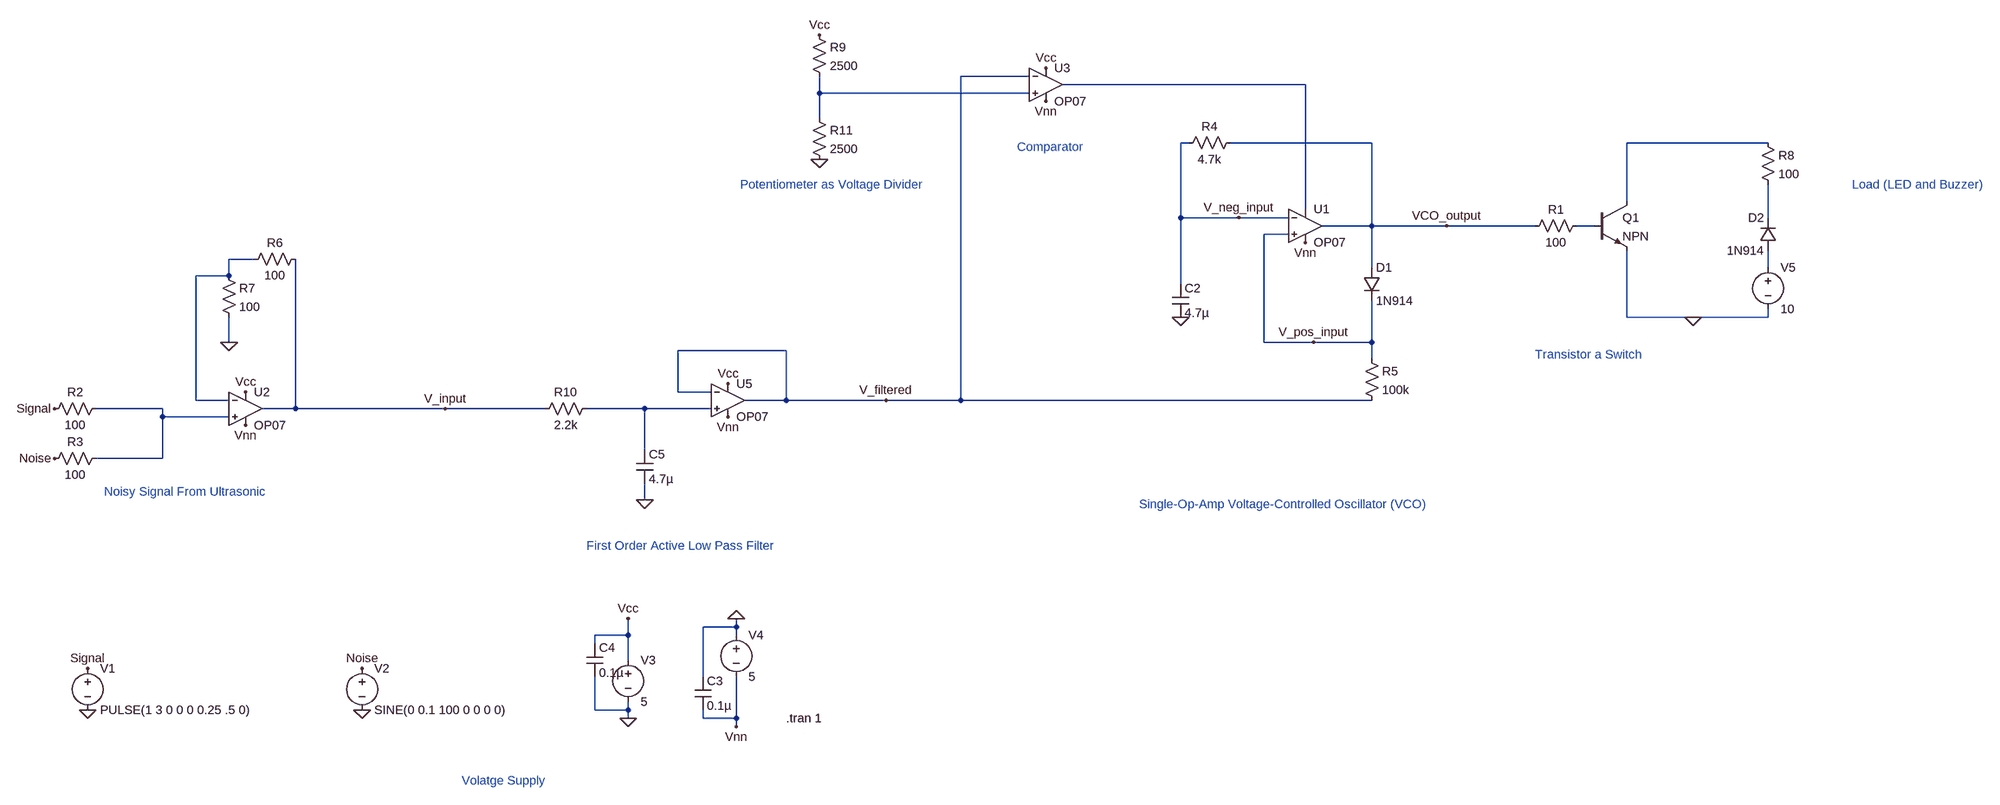
[diagram p0: schematic Group86_LTSPICE_CarSensorasc.asc]
Group86_LTSPICE_CarSensorasc.asc, the LTspice schematic file:
Version 4
SHEET 1 5500 1912
WIRE 1392 -304 1120 -304
WIRE 2048 -288 1456 -288
WIRE 848 -272 848 -304
WIRE 1392 -272 848 -272
WIRE 848 -224 848 -272
WIRE 1824 -176 1808 -176
WIRE 2176 -176 1904 -176
WIRE 3040 -176 2768 -176
WIRE 2768 -64 2768 -176
WIRE 2048 -48 2048 -288
WIRE 1808 -32 1808 -176
WIRE 1920 -32 1808 -32
WIRE 2016 -32 1920 -32
WIRE 3040 -32 3040 -96
WIRE 2176 -16 2176 -176
WIRE 2176 -16 2080 -16
WIRE 2320 -16 2176 -16
WIRE 2592 -16 2320 -16
WIRE 2704 -16 2672 -16
WIRE 2016 0 1968 0
WIRE -240 48 -288 48
WIRE 2176 64 2176 -16
WIRE 3040 64 3040 32
WIRE -288 80 -288 48
WIRE -288 80 -352 80
WIRE 1808 96 1808 -32
WIRE 2768 160 2768 32
WIRE 2896 160 2768 160
WIRE 3040 160 3040 144
WIRE 3040 160 2896 160
WIRE -288 208 -288 160
WIRE 1968 208 1968 0
WIRE 2064 208 1968 208
WIRE 2176 208 2176 128
WIRE 2176 208 2064 208
WIRE 784 224 576 224
WIRE 2176 240 2176 208
WIRE 576 304 576 224
WIRE 640 304 576 304
WIRE -352 320 -352 80
WIRE -288 320 -352 320
WIRE 784 320 784 224
WIRE 784 320 704 320
WIRE 976 320 784 320
WIRE 1120 320 1120 -304
WIRE 1120 320 976 320
WIRE 2176 320 1120 320
WIRE -416 336 -544 336
WIRE -160 336 -160 48
WIRE -160 336 -224 336
WIRE 128 336 -160 336
WIRE 320 336 128 336
WIRE 512 336 400 336
WIRE 640 336 512 336
WIRE -416 352 -416 336
WIRE -288 352 -416 352
WIRE 512 416 512 336
WIRE -416 432 -416 352
WIRE -416 432 -544 432
WIRE 512 512 512 480
WIRE 688 880 688 864
WIRE 688 880 624 880
WIRE 480 896 480 864
WIRE 480 896 416 896
WIRE 688 896 688 880
WIRE 416 912 416 896
WIRE 480 944 480 896
WIRE 624 976 624 880
WIRE 416 1040 416 976
WIRE 480 1040 480 1024
WIRE 480 1040 416 1040
WIRE 480 1056 480 1040
WIRE 624 1056 624 1040
WIRE 688 1056 688 976
WIRE 688 1056 624 1056
WIRE 688 1072 688 1056
FLAG -560 1040 0
FLAG -560 960 Signal
FLAG -32 960 Noise
FLAG -32 1040 0
FLAG -624 336 Signal
FLAG -624 432 Noise
FLAG 480 864 Vcc
FLAG 480 1056 0
FLAG 688 864 0
FLAG 688 1072 Vnn
FLAG -256 304 Vcc
FLAG -256 368 Vnn
FLAG -288 208 0
FLAG 128 336 V_input
FLAG 1808 160 0
FLAG 2048 16 Vnn
FLAG 1424 -320 Vcc
FLAG 1424 -256 Vnn
FLAG 672 288 Vcc
FLAG 672 352 Vnn
FLAG 512 512 0
FLAG 976 320 V_filtered
FLAG 1920 -32 V_neg_input
FLAG 2064 208 V_pos_input
FLAG 2320 -16 VCO_output
FLAG 2896 160 0
FLAG 848 -144 0
FLAG 848 -384 Vcc
SYMBOL voltage -560 944 R0
WINDOW 123 0 0 Left 0
WINDOW 39 0 0 Left 0
SYMATTR InstName V1
SYMATTR Value PULSE(1 3 0 0 0 0.25 .5 0)
SYMBOL voltage -32 944 R0
WINDOW 123 0 0 Left 0
WINDOW 39 0 0 Left 0
SYMATTR InstName V2
SYMATTR Value SINE(0 0.1 100 0 0 0 0)
SYMBOL res -528 320 R90
WINDOW 0 0 56 VBottom 2
WINDOW 3 32 56 VTop 2
SYMATTR InstName R2
SYMATTR Value 100
SYMBOL res -528 416 R90
WINDOW 0 0 56 VBottom 2
WINDOW 3 32 56 VTop 2
SYMATTR InstName R3
SYMATTR Value 100
SYMBOL voltage 480 928 R0
WINDOW 123 0 0 Left 0
WINDOW 39 0 0 Left 0
SYMATTR InstName V3
SYMATTR Value 5
SYMBOL OpAmps\\OP07 -256 272 R0
SYMATTR InstName U2
SYMBOL voltage 688 880 R0
WINDOW 123 0 0 Left 0
WINDOW 39 0 0 Left 0
SYMATTR InstName V4
SYMATTR Value 5
SYMBOL res -304 64 R0
SYMATTR InstName R7
SYMATTR Value 100
SYMBOL res -144 32 R90
WINDOW 0 0 56 VBottom 2
WINDOW 3 32 56 VTop 2
SYMATTR InstName R6
SYMATTR Value 100
SYMBOL cap 608 976 R0
SYMATTR InstName C3
SYMATTR Value 0.1µ
SYMBOL cap 400 912 R0
SYMATTR InstName C4
SYMATTR Value 0.1µ
SYMBOL OpAmps\\OP07 2048 -80 R0
SYMATTR InstName U1
SYMBOL res 1808 -160 R270
WINDOW 0 32 56 VTop 2
WINDOW 3 0 56 VBottom 2
SYMATTR InstName R4
SYMATTR Value 4.7k
SYMBOL cap 1792 96 R0
SYMATTR InstName C2
SYMATTR Value 4.7µ
SYMBOL res 2160 224 R0
SYMATTR InstName R5
SYMATTR Value 100k
SYMBOL diode 2160 64 R0
SYMATTR InstName D1
SYMATTR Value 1N914
SYMATTR Description Light Emitting Diode
SYMATTR Type led
SYMBOL OpAmps\\OP07 1424 -352 R0
SYMATTR InstName U3
SYMBOL res 416 320 R90
WINDOW 0 0 56 VBottom 2
WINDOW 3 32 56 VTop 2
SYMATTR InstName R10
SYMATTR Value 2.2k
SYMBOL OpAmps\\OP07 672 256 R0
SYMATTR InstName U5
SYMBOL cap 496 416 R0
SYMATTR InstName C5
SYMATTR Value 4.7µ
SYMBOL npn 2704 -64 R0
SYMATTR InstName Q1
SYMBOL res 2688 -32 R90
WINDOW 0 0 56 VBottom 2
WINDOW 3 32 56 VTop 2
SYMATTR InstName R1
SYMATTR Value 100
SYMBOL diode 3056 32 R180
WINDOW 0 24 64 Left 2
WINDOW 3 24 0 Left 2
SYMATTR InstName D2
SYMATTR Value 1N914
SYMATTR Description Light Emitting Diode
SYMATTR Type led
SYMBOL res 3024 -192 R0
SYMATTR InstName R8
SYMATTR Value 100
SYMBOL voltage 3040 48 R0
WINDOW 123 0 0 Left 0
WINDOW 39 0 0 Left 0
SYMATTR InstName V5
SYMATTR Value 10
SYMBOL res 832 -400 R0
SYMATTR InstName R9
SYMATTR Value 2500
SYMBOL res 832 -240 R0
SYMATTR InstName R11
SYMATTR Value 2500
TEXT 784 1056 Left 2 !.tran 1
TEXT -528 496 Left 2 ;Noisy Signal From Ultrasonic
TEXT 160 1176 Left 2 ;Volatge Supply
TEXT 400 600 Left 2 ;First Order Active Low Pass Filter
TEXT 696 -96 Left 2 ;Potentiometer as Voltage Divider
TEXT 1728 520 Left 2 ;Single-Op-Amp Voltage-Controlled Oscillator (VCO)
TEXT 1368 -168 Left 2 ;Comparator
TEXT 2592 232 Left 2 ;Transistor a Switch
TEXT 3232 -96 Left 2 ;Load (LED and Buzzer)

The netlist it stands for:
* Group86_LTSPICE_CarSensorasc.asc
V1 Signal 0 PULSE(1 3 0 0 0 0.25 .5 0)
V2 Noise 0 SINE(0 0.1 100 0 0 0 0)
R2 N008 Signal 100
R3 N008 Noise 100
V3 Vcc 0 5
XU2 N008 N006 Vcc Vnn V_input LT1001  ; OP07, pins In+ In- V+ V- OUT
V4 0 Vnn 5
R7 N006 0 100
R6 V_input N006 100
C3 0 Vnn 0.1µ
C4 Vcc 0 0.1µ
XU1 V_pos_input V_neg_input N001 Vnn VCO_output LT1001  ; OP07, pins In+ In- V+ V- OUT
R4 V_neg_input VCO_output 4.7k
C2 V_neg_input 0 4.7µ
R5 V_pos_input V_filtered 100k
D1 VCO_output V_pos_input 1N914
XU3 N002 V_filtered Vcc Vnn N001 LT1001  ; OP07, pins In+ In- V+ V- OUT
R10 N009 V_input 2.2k
XU5 N009 V_filtered Vcc Vnn V_filtered LT1001  ; OP07, pins In+ In- V+ V- OUT
C5 N009 0 4.7µ
Q1 N003 N005 0 0 NPN
R1 N005 VCO_output 100
D2 N007 N004 1N914
R8 N003 N004 100
V5 N007 0 10
R9 Vcc N002 2500
R11 N002 0 2500
.model D D
.lib standard.dio
.model NPN NPN
.model PNP PNP
.lib standard.bjt
.tran 1
* Noisy Signal From Ultrasonic
* Volatge Supply
* First Order Active Low Pass Filter
* Potentiometer as Voltage Divider
* Single-Op-Amp Voltage-Controlled Oscillator (VCO)
* Comparator
* Transistor a Switch
* Load (LED and Buzzer)
.lib LTC.lib
.backanno
.end